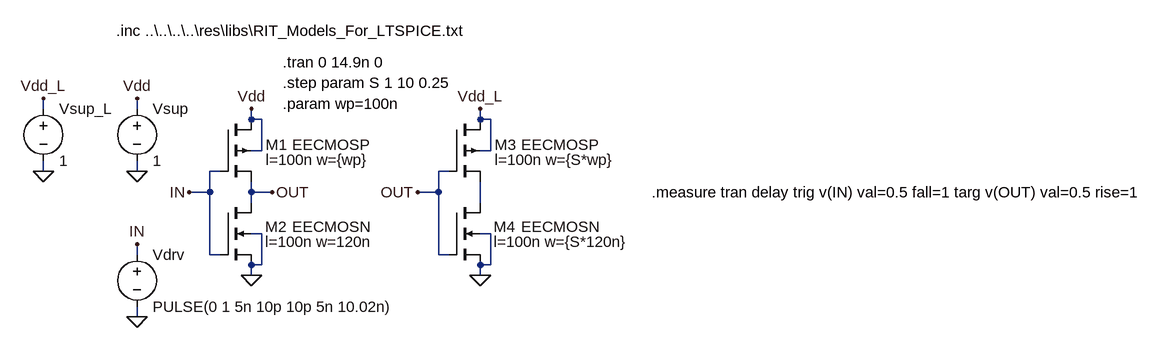
[diagram p0: schematic inverter_gamma_D.asc]
inverter_gamma_D.asc, the LTspice schematic file:
Version 4
SHEET 1 1996 680
WIRE -128 48 -128 32
WIRE 16 48 16 32
WIRE 192 64 192 48
WIRE 208 64 192 64
WIRE 544 64 544 48
WIRE 560 64 544 64
WIRE 208 112 208 64
WIRE 208 112 192 112
WIRE 560 112 560 64
WIRE 560 112 544 112
WIRE -128 144 -128 128
WIRE 16 144 16 128
WIRE 144 144 128 144
WIRE 496 144 480 144
WIRE 128 176 128 144
WIRE 128 176 96 176
WIRE 192 176 192 160
WIRE 224 176 192 176
WIRE 480 176 480 144
WIRE 480 176 448 176
WIRE 192 192 192 176
WIRE 544 192 544 160
WIRE 208 240 192 240
WIRE 560 240 544 240
WIRE 16 272 16 256
WIRE 128 272 128 176
WIRE 144 272 128 272
WIRE 480 272 480 176
WIRE 496 272 480 272
WIRE 208 288 208 240
WIRE 208 288 192 288
WIRE 560 288 560 240
WIRE 560 288 544 288
WIRE 192 304 192 288
WIRE 544 304 544 288
WIRE 16 368 16 352
FLAG 192 304 0
FLAG 192 48 Vdd
FLAG 96 176 IN
FLAG 224 176 OUT
FLAG 16 256 IN
FLAG 16 32 Vdd
FLAG 16 368 0
FLAG 16 144 0
FLAG 544 304 0
FLAG 544 48 Vdd_L
FLAG 448 176 OUT
FLAG -128 32 Vdd_L
FLAG -128 144 0
SYMBOL voltage 16 32 R0
WINDOW 123 0 0 Left 0
WINDOW 39 0 0 Left 0
SYMATTR InstName Vsup
SYMATTR Value 1
SYMBOL voltage 16 256 R0
WINDOW 123 0 0 Left 0
WINDOW 39 0 0 Left 0
SYMATTR InstName Vdrv
SYMATTR Value PULSE(0 1 5n 10p 10p 5n 10.02n)
SYMBOL pmos4 144 64 R0
WINDOW 0 70 39 Left 2
WINDOW 3 111 39 Left 2
WINDOW 123 70 62 Left 2
SYMATTR InstName M1
SYMATTR Value EECMOSP
SYMATTR Value2 l=100n w={wp}
SYMBOL nmos4 144 192 R0
WINDOW 0 69 37 Left 2
WINDOW 3 111 37 Left 2
WINDOW 123 69 60 Left 2
SYMATTR InstName M2
SYMATTR Value EECMOSN
SYMATTR Value2 l=100n w=120n
SYMBOL pmos4 496 64 R0
WINDOW 0 70 39 Left 2
WINDOW 3 111 39 Left 2
WINDOW 123 70 62 Left 2
SYMATTR InstName M3
SYMATTR Value EECMOSP
SYMATTR Value2 l=100n w={S*wp}
SYMBOL nmos4 496 192 R0
WINDOW 0 69 37 Left 2
WINDOW 3 111 37 Left 2
WINDOW 123 69 60 Left 2
SYMATTR InstName M4
SYMATTR Value EECMOSN
SYMATTR Value2 l=100n w={S*120n}
SYMBOL voltage -128 32 R0
WINDOW 123 0 0 Left 0
WINDOW 39 0 0 Left 0
SYMATTR InstName Vsup_L
SYMATTR Value 1
TEXT -16 -72 Left 2 !.inc ..\\..\\..\\..\\res\\libs\\RIT_Models_For_LTSPICE.txt
TEXT 240 -24 Left 2 !.tran 0 14.9n 0
TEXT 240 8 Left 2 !.step param S 1 10 0.25
TEXT 240 40 Left 2 !.param wp=100n
TEXT 808 176 Left 2 !.measure tran delay trig v(IN) val=0.5 fall=1 targ v(OUT) val=0.5 rise=1

The netlist it stands for:
* inverter_gamma_D.asc
Vsup Vdd 0 1
Vdrv IN 0 PULSE(0 1 5n 10p 10p 5n 10.02n)
M1 Vdd IN OUT Vdd EECMOSP l=100n w={wp}
M2 OUT IN 0 0 EECMOSN l=100n w=120n
M3 Vdd_L OUT N001 Vdd_L EECMOSP l=100n w={S*wp}
M4 N001 OUT 0 0 EECMOSN l=100n w={S*120n}
Vsup_L Vdd_L 0 1
.model NMOS NMOS
.model PMOS PMOS
.lib standard.mos
.inc ..\..\..\..\res\libs\RIT_Models_For_LTSPICE.txt
.tran 0 14.9n 0
.step param S 1 10 0.25
.param wp=100n
.measure tran delay trig v(IN) val=0.5 fall=1 targ v(OUT) val=0.5 rise=1
.backanno
.end